# Altium schematic sheet RTC_and_EEPROM.SchDoc
size A3; SheetNumber: 8; SheetTotal: 9
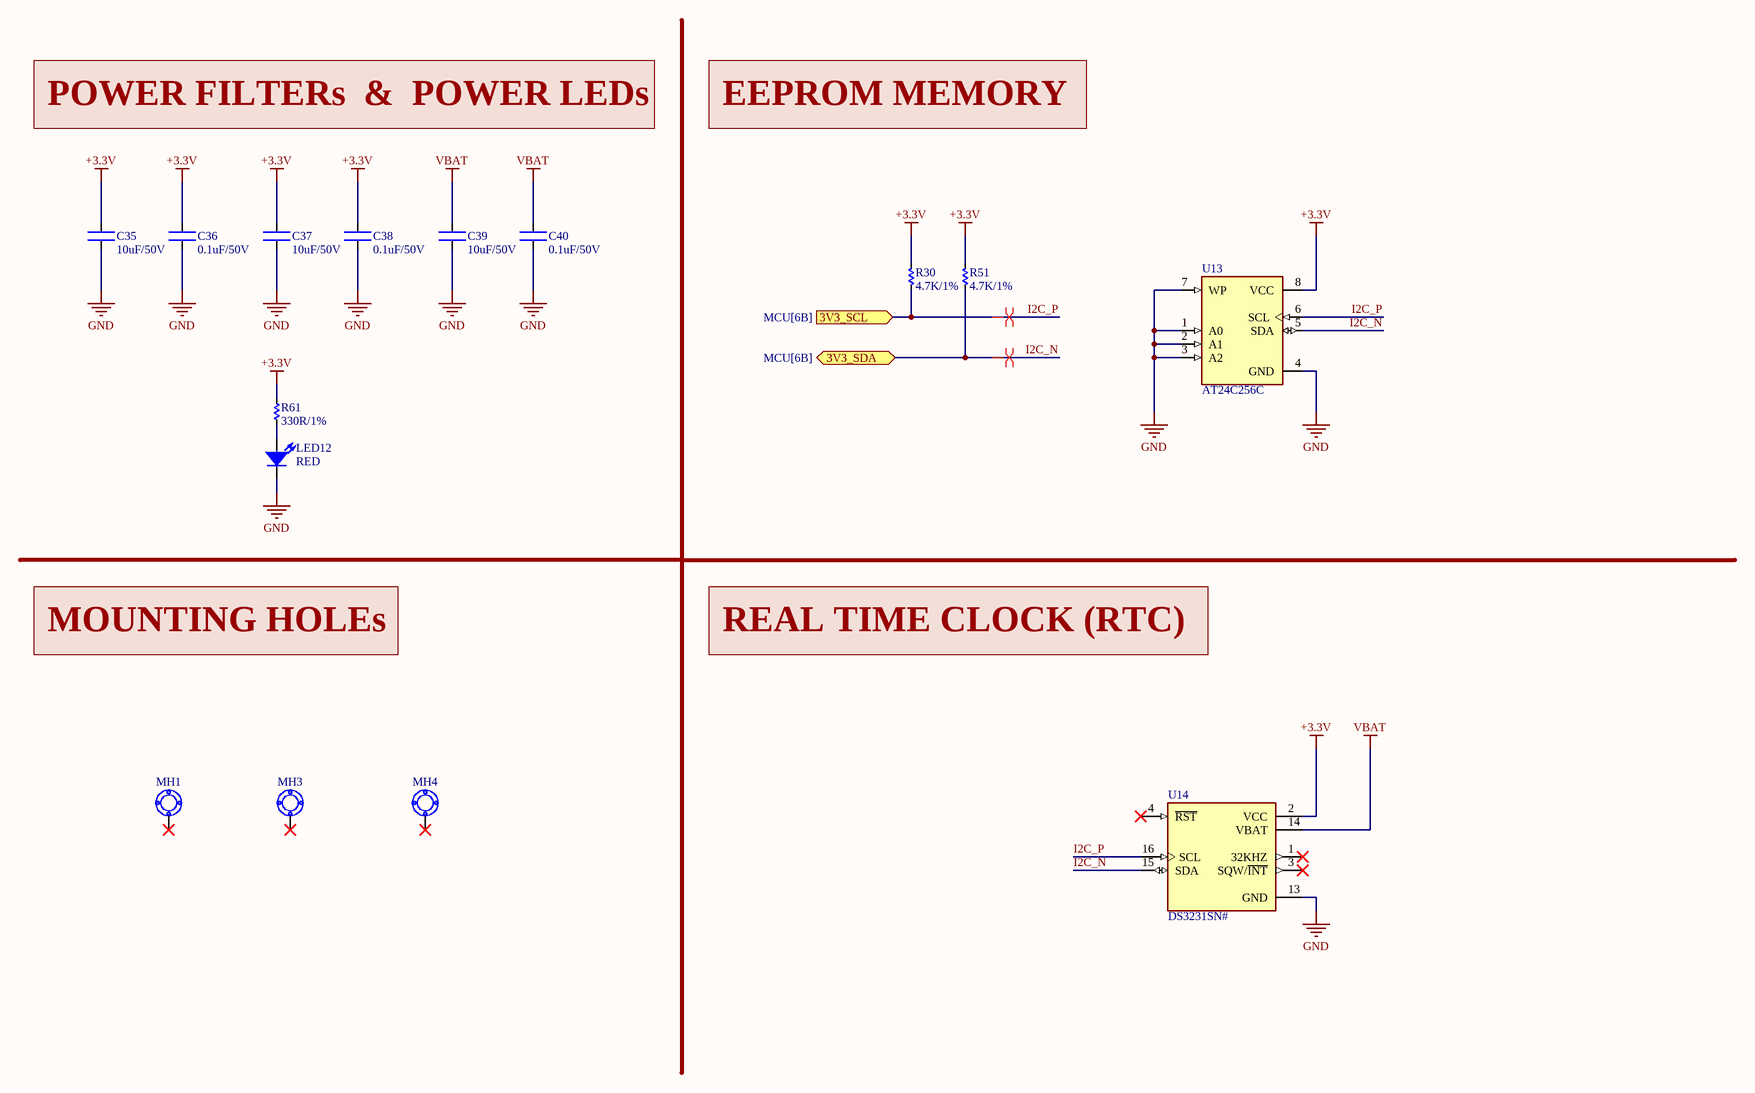
[diagram p0: RTC_and_EEPROM.SchDoc]

## Parts
C35  10uF/50V  [CAP - 0603]
C36  0.1uF/50V  [CAP - 0603]
C37  10uF/50V  [CAP - 0603]
C38  0.1uF/50V  [CAP - 0603]
C39  10uF/50V  [CAP - 0603]
C40  0.1uF/50V  [CAP - 0603]
LED12  RED  [RED_LED_0603]
MH1  MOUNTING HOLE  [Mounting hole_2]  (value not drawn)
MH3  MOUNTING HOLE  [Mounting hole_2]  (value not drawn)
MH4  MOUNTING HOLE  [Mounting hole_2]  (value not drawn)
R30  4.7K/1%  [RES - 0603]
R51  4.7K/1%  [RES - 0603]
R61  330R/1%  [RES - 0603]
U13  AT24C256C  [SOIC-8]
U14  DS3231SN#  [SOIC -16]

## Ports
3V3_SCL (in, see MCU[6B]), 3V3_SDA (bidir, see MCU[6B])

## Nets
+3.3V: C35.2 C36.2 C37.2 C38.2 R30.2 R51.2 R61.1 U13.8(VCC) U14.2(VCC)
GND: C35.1 C36.1 C37.1 C38.1 C39.1 C40.1 LED12.2 U13.1(A0) U13.2(A1) U13.3(A2) U13.4(GND) U13.7(WP) U14.13(GND)
VBAT: C39.2 C40.2 U14.14(VBAT)
I2C_N: R51.1 U13.5(SDA) U14.15(SDA) ; port 3V3_SDA
I2C_P: R30.1 U13.6(SCL) U14.16(SCL) ; port 3V3_SCL
NetLED12_1: LED12.1 R61.2

Not connected (* = marked no-connect by the designer): MH1 1(76)*; MH3 1(76)*; MH4 1(76)*; U14 1(32KHZ)* 3(SQW/~{INT})* 4(~{RST})*

## Layout directives
differential pair: I2C_N, I2C_P

## Notes on the sheet
- POWER FILTERs  &  POWER LEDs
- EEPROM MEMORY
- MOUNTING HOLEs
- REAL TIME CLOCK (RTC)

## Library data of the parts
C35-C40 = CAPACITOR: CAPACITOR SMD - KEMET
LED12 = LED_SMD: LED SMD
R30 R51 R61 = RESISTOR: Resistor SMD - YAGEO
U13 = AT24C256C: EEPROM Memory IC 256Kb (32K x 8), I2C Protocol
U14 = DS3231SN#: Extremely Accurate I²C-Integrated RTC/TCXO/Crystal